# EAGLE design thermostat-v1 (EAGLE 7.7.0)
DESIGNER: K. GOBA
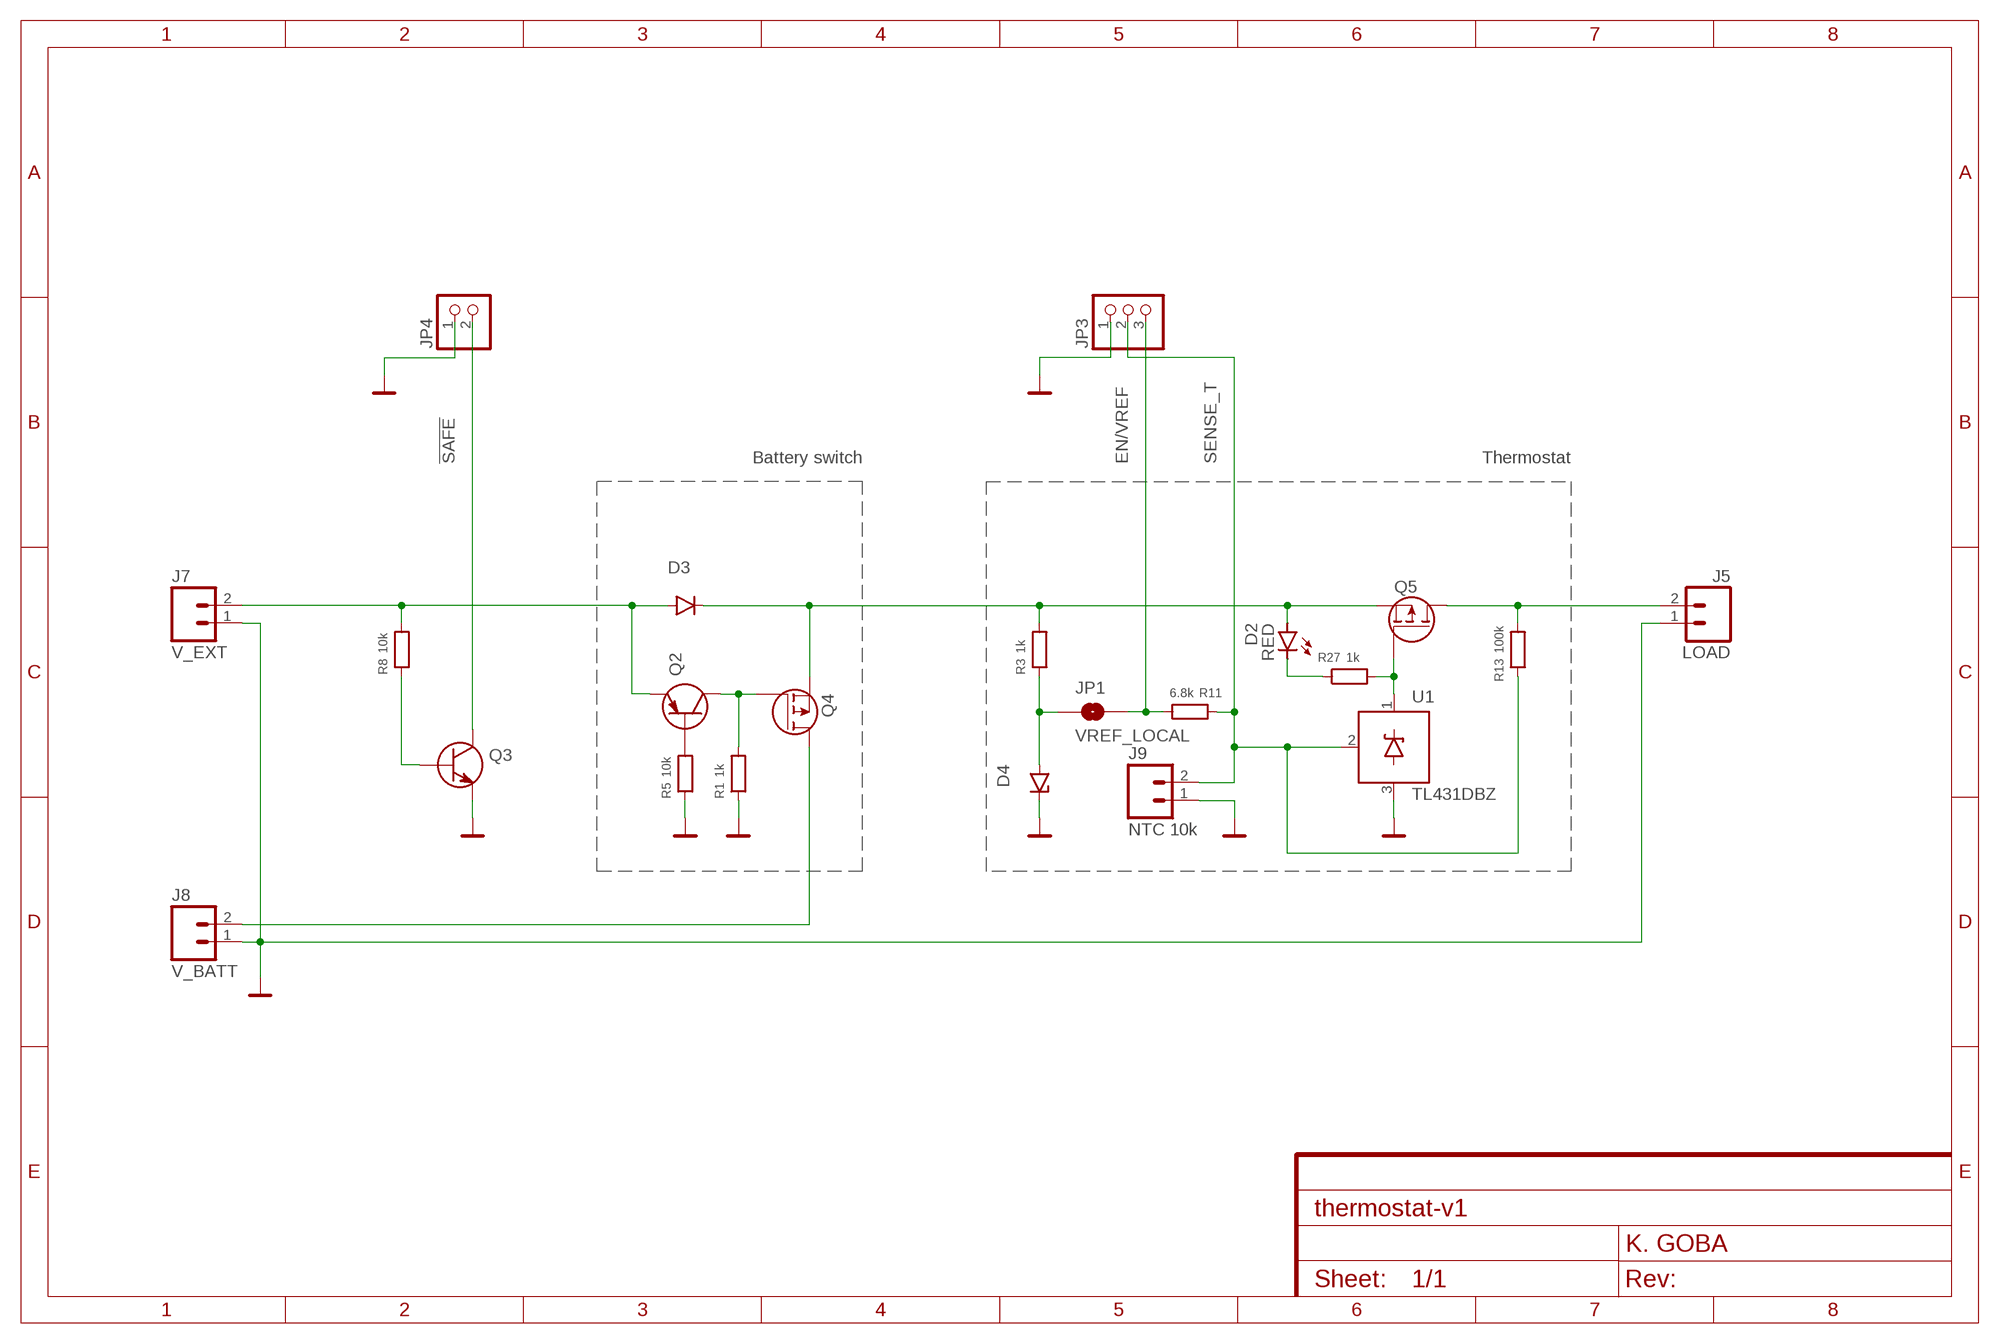
[diagram p0: schematic, sheet 1]

## Parts
D2  RED  LED0805  [R0805]
D3  DIODE-SMA-ALT  [D-SMA-ALT]
D4  DIODE-ZENER-SOD80  [SOD80]
J5  LOAD  M2-3.50MM  [SCREWTERMINAL-3.5MM-2]
J7  V_EXT  M2-3.50MM  [SCREWTERMINAL-3.5MM-2]
J8  V_BATT  M2-2MM-JST-H  [JST-2-PTH]
J9  NTC 10k  M2-2.54MM  [1X02]
JP1  VREF_LOCAL  JUMPER-SMT_2_NO_NO-SILK  [SMT-JUMPER_2_NO_NO-SILK]
JP3  PINHD-1X3  [1X03]
JP4  PINHD-1X2  [1X02]
Q2  BJT-PNPSMD  [SOT23-3]
Q3  BJT-NPN-SOT23-3  [SOT23-3]
Q4  MOSFET-P-SOT23-3  [SOT23-3]
Q5  MOSFET-P-SOT23-3  [SOT23-3]
R1  1k  RESISTOR-0603  [R0603]
R3  1k  RESISTOR-0603  [R0603]
R5  10k  RESISTOR-0603  [R0603]
R8  10k  RESISTOR-0603  [R0603]
R11  6.8k  RESISTOR-0603  [R0603]
R13  100k  RESISTOR-0603  [R0603]
R27  1k  RESISTOR-0603  [R0603]
U1  TL431DBZ  [SOT23-3]

## Nets
!SAFE: JP4.2 Q3.3(C)
EN/VREF: JP1.2 JP3.3 R11.2
GND: D4.C J5.1 J7.1 J8.1 J9.1 JP3.1 JP4.1 Q3.2(E) R1.1 R5.1 U1.3(A)
N$5: D2.2(C) R27.1
N$8: D4.A JP1.1 R3.1
N$13: D2.1(A) D3.C Q4.2(S) Q5.2(S) R3.2
N$14: Q2.3(C) Q4.1(G) R1.2
N$15: J8.2 Q4.3(D)
N$16: Q2.1(B) R5.2
N$17: D3.A J7.2 Q2.2(E) R8.2
N$21: Q3.1(B) R8.1
N$23: Q5.1(G) R27.2 U1.1(C)
N$25: J5.2 Q5.3(D) R13.2
SENSE_T: J9.2 JP3.2 R11.1 R13.1 U1.2(R)

## Notes on the sheet
- Battery switch | Thermostat

## Library data of the parts
D2 = kg-generic:LED: LEDs Standard schematic elements and footprints for 5mm, 3mm, 1206, and 0603 sized LEDs. 5mm - Spark Fun Electronics SKU : COM-00529 (and others)
D3 = kg-generic:DIODE: Diode These are standard reverse protection diodes and small signal diodes. SMA package can handle up to about 1A. SOD-323 can handle about 200mA. What the SOD-323 package when ordering, there are some mfgs out there that are 5-pin packages.
D4 = kg-generic:DIODE-ZENER: Zener Diode Production Part - 8199 3.4V Zener Voltage
J5 J7-J9 = kg-amp-ct:M2: 2 pin male header/connector
JP1 = SparkFun-Jumpers:JUMPER-SMT_2_NO: Normally open jumper This jumper has two pads in close proximity to each other. Apply solder to close the connection. Round pads are easier to solder for beginners, but are a lot larger. SparkFun Product that uses the round pads: SparkFun EL Sequencer <https://www.sparkfun.com/products/12781>
JP3 = pinhead:PINHD-1X3: PIN HEADER
JP4 = pinhead:PINHD-1X2: PIN HEADER
Q2 = kg-generic:BJT-PNP: Generic PNP BJT Double check pinouts against datasheets- not all devices are the same! MMBT3906 - 40V 200mA SOT-23 (TRANS-08052) MMBT4403 - 40V 600mA SOT-23 (TRANS-09245)
Q3 = kg-generic:BJT-NPN: Generic NPN BJT BC547 (TO-92 45V 100mA) (1.Collector 2.Base 3.Emitter) 2N3904 (TO-92 40V 200mA) (1.Emitter 2.Base 3.Collector) 2N2222A (TO-92 40V 600mA) (1.Collector 2.Base 3.Emitter)
Q4 Q5 = kg-generic:MOSFET-P: Generic P-MOSFET IRF7406 SO8 30V 5.8A 45mOhm IRLML6401 SOT23-3 12V 4.3A 50mOhm IRLML6402 SOT23-3 20V 3.7A 65mOhm
R1 R3 R5 R8 R11 R13 R27 = kg-generic:RESISTOR: Generic resistor
U1 = kg-supply:TL431: Precision Programmable Reference

## Board
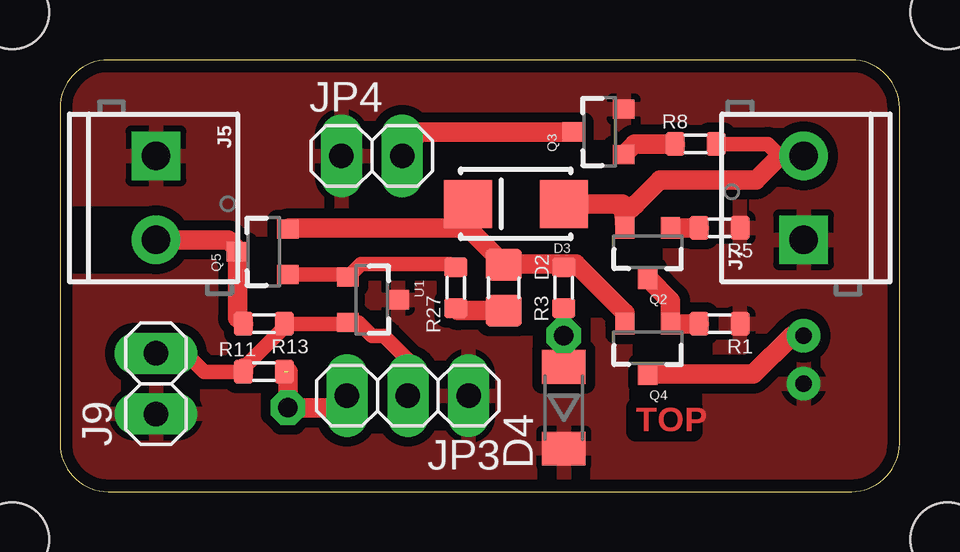
[diagram p1: board, top side]
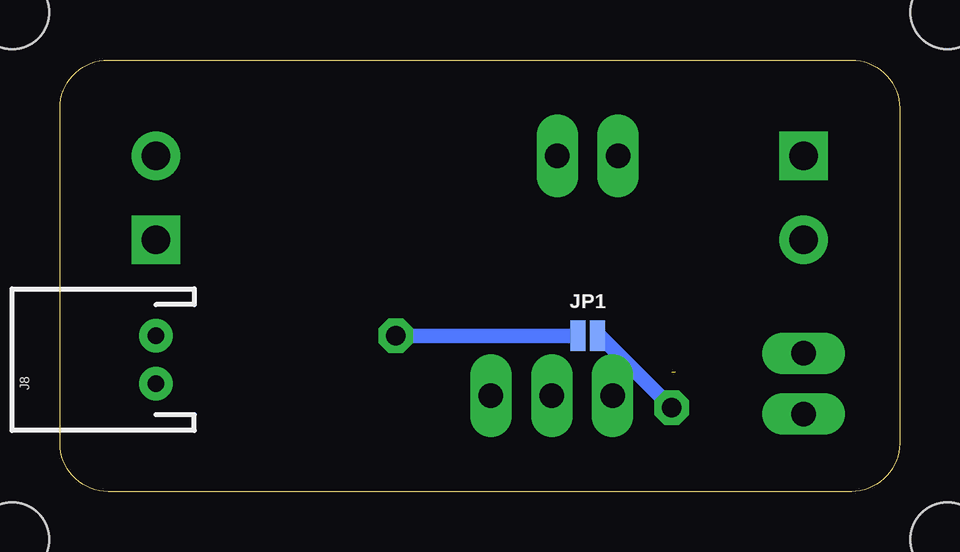
[diagram p2: board, bottom side, seen from below]

Size 35 x 18 mm. Coordinates in mm from the lower left corner, seen from the top.
Outline: 35,2 35,16 arc90 33,18 2,18 arc90 0,16 0,2 arc90 2,0 33,0 arc90 35,2
Copper layers (1*16): Top 0.035mm / dielectric 1.5mm / Bottom 0.035mm
Design rules "ShenZhen2U_2layer_EagleRules *": minimum track width 7mil, minimum drill 12mil, track to track 7mil, track to pad 7mil, pad to pad 7mil, via to via 7mil, smd to smd 0mil, copper to edge 20mil, drill to drill 10mil, minimum pad ring 14mil, minimum via ring 6mil, stop-mask expansion 2mil, vias tented up to drill 25mil, thermal gap 10mil
Holes 3.1 mm at 37,20 -2,-2 37,-2 -2,20
tRestrict: area -0.5,9.5 to 4,11.5

### Footprints (pad centres in the part's own frame; a part is rotated, then mirrored left to right if it is on the bottom)
R0805 = smd 1.3 x 1.5: 1 -0.95,0; 2 0.95,0
D-SMA-ALT = smd 2 x 2: A -2,0; C 2,0
SOD80 = smd 1.4 x 1.8: A 1.7,0; C -1.7,0
SCREWTERMINAL-3.5MM-2 = drill 1.2 pad 2.032 square: 1 0,0 | drill 1.2 pad 2.032: 2 3.5,0
JST-2-PTH = drill 0.7: 1 -1,0; 2 1,0
1X02 = drill 1.016 long: 1 -1.27,0; 2 1.27,0
SMT-JUMPER_2_NO_NO-SILK = smd 0.635 x 1.27: 1 -0.406,0; 2 0.406,0
1X03 = drill 1.016 long: 1 -2.54,0; 2 0,0; 3 2.54,0
SOT23-3 = smd 0.8 x 0.9: 1 -0.95,-1; 2 0.95,-1; 3 0,1.1
R0603 = smd 0.8 x 0.95: 1 -0.85,0; 2 0.85,0

### Placement (x,y rotation side)
D2  18.5,8.5 270 top
D3  19,12 180 top
D4  21,3.5 90 top
J5  4,14 270 top
J7  31,10.5 90 top
J8  31,5.5 90 bottom
J9  4,4.5 90 top
JP1  13,6.5 0 bottom
JP3  14.5,4 180 top
JP4  13,14 0 top
Q2  24.5,10 180 top
Q3  22.5,15 90 top
Q4  24.5,6 180 top
Q5  8.5,10 90 top
R1  27.5,7 180 top
R3  21,8.5 90 top
R5  27.5,11 180 top
R8  26.5,14.5 0 top
R11  8.5,5 0 top
R13  8.5,7 180 top
R27  16.5,8.5 90 top
U1  13,8 270 top

### Tracks (layer width: path | path; a pad name or v marks a point on that pad's centre or on a via)
!SAFE
  Top 0.813: Q3.3 15,15 14.27,14.27 JP4.2
EN/VREF  (via drill 0.8 pad 1.42)  (1 unrouted)
  Top 0.813: 9.5,5 v9.5,3.5 11.5,3.5 11.96,3.96 JP3.3
  Bottom 0.61: JP1.2 12.59,6.59 v9.5,3.5
GND
  pour Top (isolate 0.406): 0,0 35,0 35,18 0,18
N$5
  Top 0.813: D2.2 16.6,7.55 R27.1
N$8  (via drill 0.8 pad 1.42)
  Top 0.61: R3.1 v21,6.5 D4.A
  Bottom 0.61: JP1.1 v21,6.5
N$13
  Top 0.61: R3.2 21.5,9.5
  Top 0.813: Q4.2 23.55,7.45 21.5,9.5 18.5,9.5 | D3.C 16.85,11.15 17,11 | 17,11 9.55,11 Q5.2 | D2.1 18.5,9.5 | 18.5,9.5 17,11
N$14
  Top 0.813: Q2.3 25.45,7.95 Q4.1 R1.2
N$15
  Top 0.813: Q4.3 28.9,4.9 30.5,6.5 J8.2
N$16
  Top 0.813: Q2.1 R5.2
N$17
  Top 0.61: R8.2 29.5,14.5 30,14
  Top 0.813: J7.2 30,14 29,13 25,13 24,12 23.5,11.55 | 23.5,11.55 Q2.2 | D3.A 23.45,12 23.5,11.55
N$21
  Top 0.813: R8.1 23.95,14.5 Q3.1
N$23
  Top 0.61: Q5.1 11.9,9.05 U1.1 12.55,9.5 16.25,9.5 16.4,9.35 R27.2
N$25
  Top 0.813: J5.2 7,10.5 7.4,10.1 Q5.3 7.4,7.25 R13.2
SENSE_T
  Top 0.61: 7.65,5.15 9.35,6.85 R13.1 11.95,7 U1.2 12.45,7.05 13,6.5 13.5,6.5 14.5,5.5 JP3.2 | J9.2 5.23,5.77 6,5 R11.1
  Top 0.813: R11.1 7.65,5.15

### Text on the board
Top: TOP
Document: TODO: / - TABS for battery straps / - Check buzzer size / - Wire widths